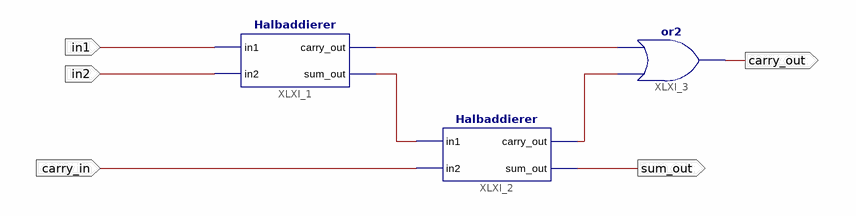
[diagram p0: schematic sheet 1]
// Xilinx ISE schematic Volladdierer.sch (spartan3e) as structural Verilog: 3 symbols, 5 ports
module Volladdierer (
  input  in1,
  input  in2,
  input  carry_in,
  output sum_out,
  output carry_out
);

  wire XLXN_4, XLXN_5, XLXN_6;

  Halbaddierer XLXI_1 (.in1(in1), .in2(in2), .carry_out(XLXN_5), .sum_out(XLXN_4));
  Halbaddierer XLXI_2 (.in1(XLXN_4), .in2(carry_in), .carry_out(XLXN_6), .sum_out(sum_out));
  or XLXI_3 (carry_out, XLXN_6, XLXN_5);
endmodule
